# Altium schematic sheet Drives.SchDoc
size B; Organization: Altium Limited; Address1: L3, 12a Rodborough Rd; Address2: Frenchs Forest; Address3: NSW; Address4: Australia 2086
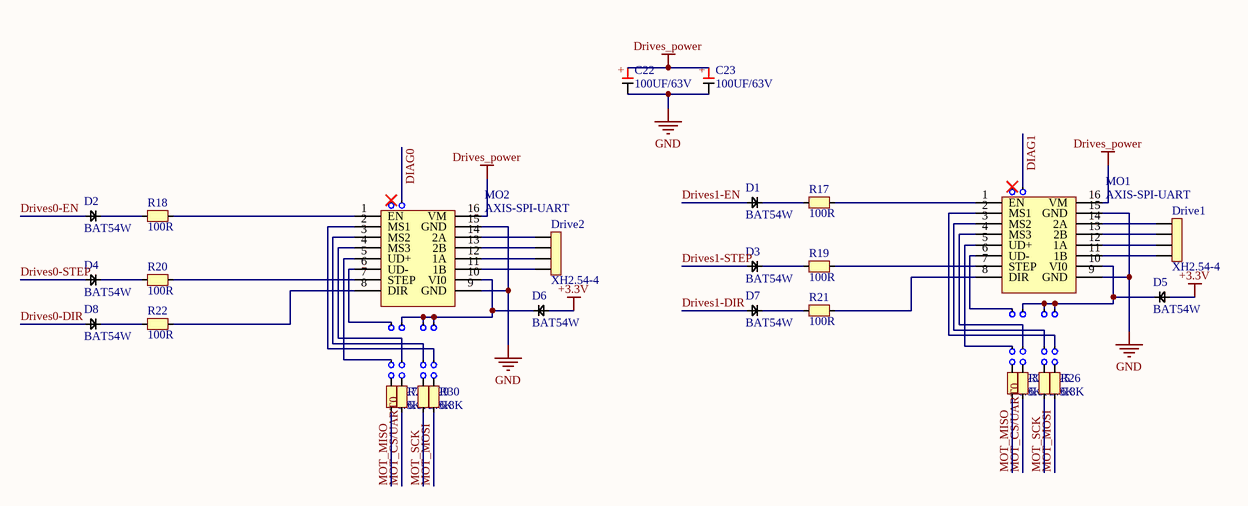
[diagram p0: Drives.SchDoc]

## Parts
C22  100UF/63V  [10*10.5电解电容]
C23  100UF/63V  [10*10.5电解电容]
D1  BAT54W  [SOD-123]
D2  BAT54W  [SOD-123]
D3  BAT54W  [SOD-123]
D4  BAT54W  [SOD-123]
D5  BAT54W  [SOD-123]
D6  BAT54W  [SOD-123]
D7  BAT54W  [SOD-123]
D8  BAT54W  [SOD-123]
Drive1  XH2.54-4  [XH2.54-4]
Drive2  XH2.54-4  [XH2.54-4]
MO1  AXIS-SPI-UART  [AXIS-SPI-UART]
MO2  AXIS-SPI-UART  [AXIS-SPI-UART]
R17  100R  [0603]
R18  100R  [0603]
R19  100R  [0603]
R20  100R  [0603]
R21  100R  [0603]
R22  100R  [0603]
R23  6.8K  [0603]
R24  6.8K  [0603]
R25  6.8K  [0603]
R26  6.8K  [0603]
R27  6.8K  [0603]
R28  6.8K  [0603]
R29  6.8K  [0603]
R30  6.8K  [0603]

## Nets
+3.3V: D5.1 D6.1
Drives_power: C22.1 C23.1 MO1.16(VM) MO2.16(VM)
GND: C22.2 C23.2 MO1.9(GND) MO1.15(GND) MO2.9(GND) MO2.15(GND)
DIAG0: MO2.30
DIAG1: MO1.30
Drives0-DIR: D8.1
Drives0-EN: D2.1
Drives0-STEP: D4.1
Drives1-DIR: D7.1
Drives1-EN: D1.1
Drives1-STEP: D3.1
MOT_CS/UART0: R24.1 R28.1
MOT_MISO: R23.1 R27.1
MOT_MOSI: R26.1 R30.1
MOT_SCK: R25.1 R29.1
NetD1_2: D1.2 R17.2
NetD2_2: D2.2 R18.2
NetD3_2: D3.2 R19.2
NetD4_2: D4.2 R20.2
NetD5_2: D5.2 MO1.10(VI0) MO1.22 MO1.23 MO1.28
NetD6_2: D6.2 MO2.10(VI0) MO2.22 MO2.23 MO2.28
NetD7_2: D7.2 R21.2
NetD8_2: D8.2 R22.2
NetDrive1_1: Drive1.1 MO1.14(2A)
NetDrive1_2: Drive1.2 MO1.13(2B)
NetDrive1_3: Drive1.3 MO1.12(1A)
NetDrive1_4: Drive1.4 MO1.11(1B)
NetDrive2_1: Drive2.1 MO2.14(2A)
NetDrive2_2: Drive2.2 MO2.13(2B)
NetDrive2_3: Drive2.3 MO2.12(1A)
NetDrive2_4: Drive2.4 MO2.11(1B)
NetMO1_1: MO1.1(EN) R17.1
NetMO1_2: MO1.2(MS1) MO1.27
NetMO1_3: MO1.3(MS2) MO1.24
NetMO1_4: MO1.4(MS3) MO1.21
NetMO1_5: MO1.5(UD+) MO1.18
NetMO1_6: MO1.6(UD-) MO1.17
NetMO1_7: MO1.7(STEP) R19.1
NetMO1_8: MO1.8(DIR) R21.1
NetMO1_19: MO1.19 R23.2
NetMO1_20: MO1.20 R24.2
NetMO1_25: MO1.25 R25.2
NetMO1_26: MO1.26 R26.2
NetMO2_1: MO2.1(EN) R18.1
NetMO2_2: MO2.2(MS1) MO2.27
NetMO2_3: MO2.3(MS2) MO2.24
NetMO2_4: MO2.4(MS3) MO2.21
NetMO2_5: MO2.5(UD+) MO2.18
NetMO2_6: MO2.6(UD-) MO2.17
NetMO2_7: MO2.7(STEP) R20.1
NetMO2_8: MO2.8(DIR) R22.1
NetMO2_19: MO2.19 R27.2
NetMO2_20: MO2.20 R28.2
NetMO2_25: MO2.25 R29.2
NetMO2_26: MO2.26 R30.2

Not connected (* = marked no-connect by the designer): MO1 29(3)*; MO2 29(3)*

## Notes on the sheet
- Title
- Size:
- Date:
- B
- Number:
- Time:
- Revision:
- Sheet
- of
- File:
- (in symbol 降压电容) +

## Library data of the parts
C22 C23 = 降压电容
D1-D8 = Diode: BAT46W
R17-R30 = R